# Altium schematic sheet PCAL64.schdoc: TITRE
size Letter; ApprovedBy: APPROUVÉ PAR; Organization: Cegep Limoilou; Address1: 1300, 8e Avenue; Address2: Québec, QC; Address3: Canada; Address4: G1J 5L5; SheetNumber: 4; SheetTotal: 6
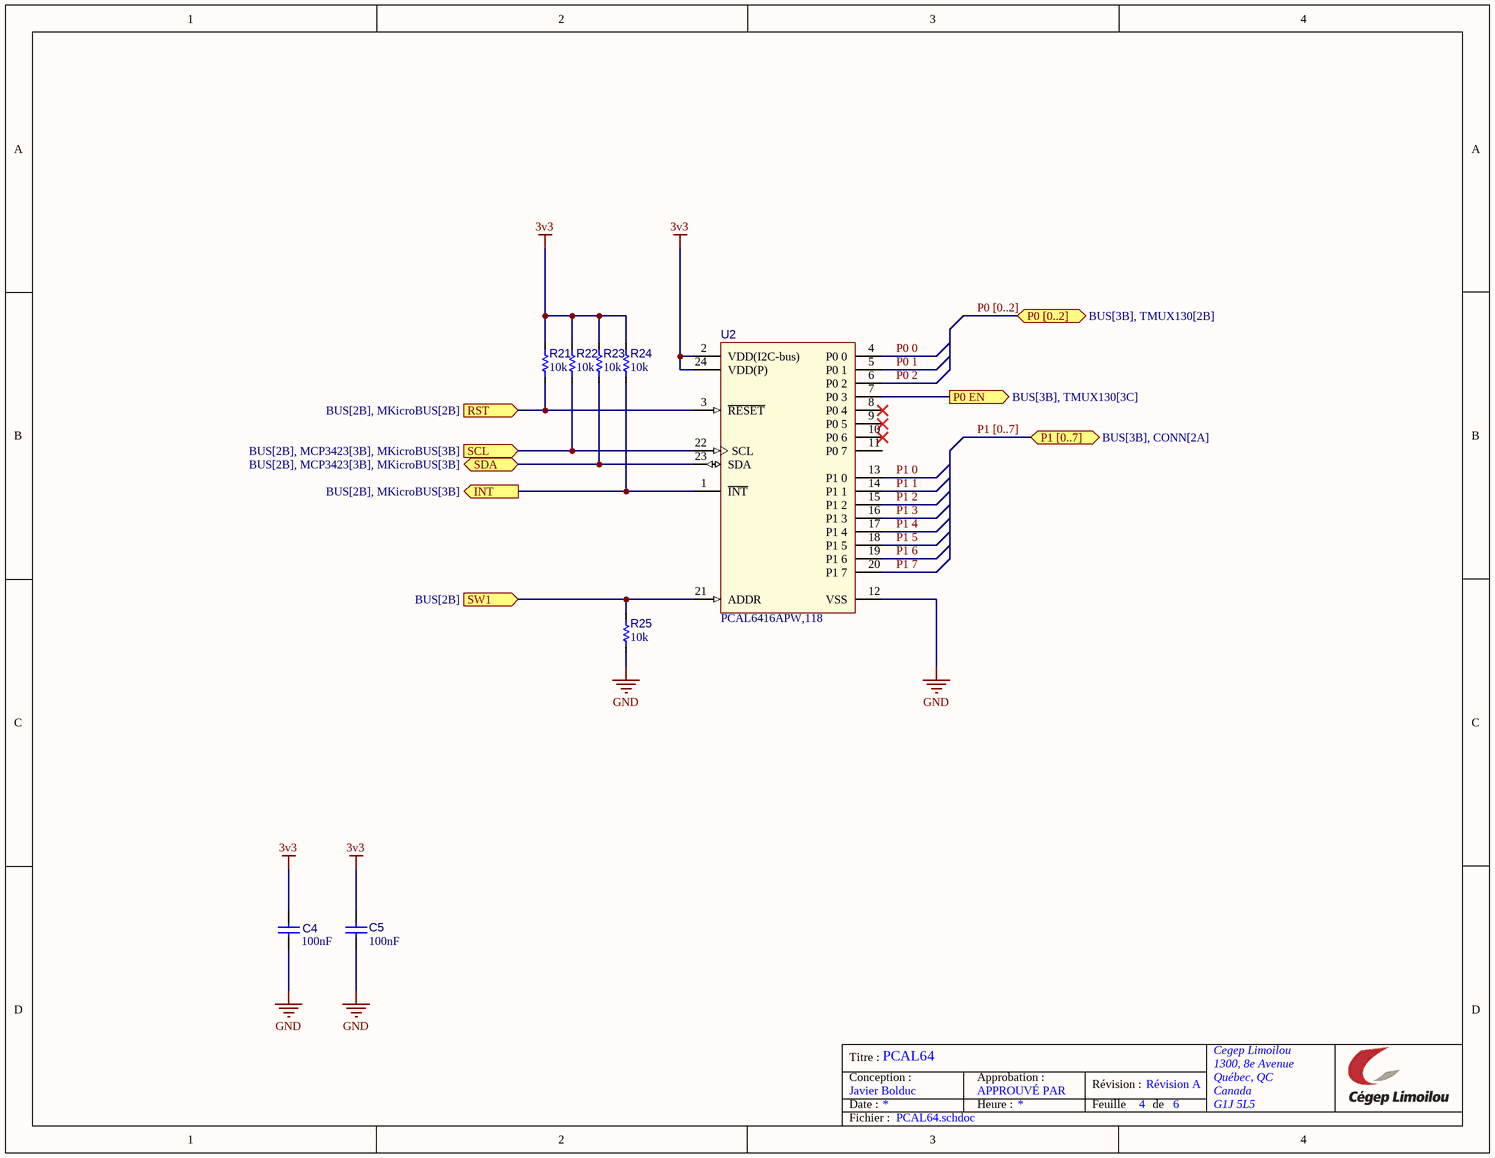
[diagram p0: PCAL64.schdoc]

## Parts
C4  value 100nF  [C_1608[0603]]  (hidden comment: CAP CER 100nF 50V 0603)
C5  value 100nF  [C_1608[0603]]  (hidden comment: CAP CER 100nF 50V 0603)
R21  value 10k  [R_1608[0603]]  (hidden comment: Res 10k 1% 0603)
R22  value 10k  [R_1608[0603]]  (hidden comment: Res 10k 1% 0603)
R23  value 10k  [R_1608[0603]]  (hidden comment: Res 10k 1% 0603)
R24  value 10k  [R_1608[0603]]  (hidden comment: Res 10k 1% 0603)
R25  value 10k  [R_1608[0603]]  (hidden comment: Res 10k 1% 0603)
U2  PCAL6416APW,118  [U_TSSOP24_SOT355-1-IPC_B]

## Ports
INT (out, see BUS[2B], MKicroBUS[3B]), P0 [0..2] (bidir, see BUS[3B], TMUX130[2B]), P0 EN (out, see BUS[3B], TMUX130[3C]), P1 [0..7] (bidir, see BUS[3B], CONN[2A]), RST (in, see BUS[2B], MKicroBUS[2B]), SCL (in, see BUS[2B], MCP3423[3B], MKicroBUS[3B]), SDA (bidir, see BUS[2B], MCP3423[3B], MKicroBUS[3B]), SW1 (in, see BUS[2B])

## Nets
3v3: C4.2 C5.2 R21.1 R22.1 R23.1 R24.1 U2.2(VDD(I2C-bus)) U2.24(VDD(P))
GND: C4.1 C5.1 R25.2 U2.12(VSS)
INT: R24.2 U2.1(~{INT}) ; port INT
P0 0: U2.4(P0_0)
P0 1: U2.5(P0_1)
P0 2: U2.6(P0_2)
P0 EN: U2.7(P0_3) ; port P0 EN
P1 0: U2.13(P1_0)
P1 1: U2.14(P1_1)
P1 2: U2.15(P1_2)
P1 3: U2.16(P1_3)
P1 4: U2.17(P1_4)
P1 5: U2.18(P1_5)
P1 6: U2.19(P1_6)
P1 7: U2.20(P1_7)
RST: R21.2 U2.3(~{RESET}) ; port RST
SCL: R22.2 U2.22(SCL) ; port SCL
SDA: R23.2 U2.23(SDA) ; port SDA
SW1: R25.1 U2.21(ADDR) ; port SW1

Not connected (* = marked no-connect by the designer): U2 8(P0_4)* 9(P0_5)* 10(P0_6)* 11(P0_7)

## Buses and harness runs
bus P0 [0..2] = port P0 [0..2]
bus P1 [0..7] = port P1 [0..7]

## Notes on the sheet
- Titre :
- Conception :
- Date :
- Javier Bolduc
- PCAL64
- Approbation :
- Heure :
- Révision :
- Feuille
- Révision A
- de
- Fichier :

## Library data of the parts
C4 C5 = CAP002: Capacitor type 1; Manufacturer 1: Yageo; Manufacturer Part Number 1: CC0603KRX7R9BB104; LibRef: CAP002; Code CEGEP: COND0143SM; Tolerance: 10%; Dielectric: X7R; Rated Voltage: 50V; Mounting Technology: SMT; Supplier 1: LCSC; Supplier Part Number 1: C14663
R21-R25 = RES001: Resistor type 1; Manufacturer 1: Yageo; Manufacturer Part Number 1: RC0603FR-0710KL; LibRef: RES001; Puissance: 1/10W; Max Working Voltage: 75V; Code CEGEP: RESI0238-0603; Tolerance: 1%; Mounting Technology: SMT; Supplier 1: LCSC; Supplier Part Number 1: C98220
U2 = U_PCAL6416APW: IC I/O EXPANDER 16BIT 24TSSOP; Manufacturer Part Number 1: TCA6416APWR; Manufacturer 1: Texas Instruments; Manufacturer 2: NXP Semiconductors; Manufacturer Part Number 2: PCAL6416APW,118; Mounting Technology: SMT; Supplier 1: LCSC; Supplier 2: LCSC; Supplier 3: Digikey; Supplier Part Number 1: C130203; Supplier Part Number 2: C2652299; Supplier Part Number 3: 568-9922-1-ND